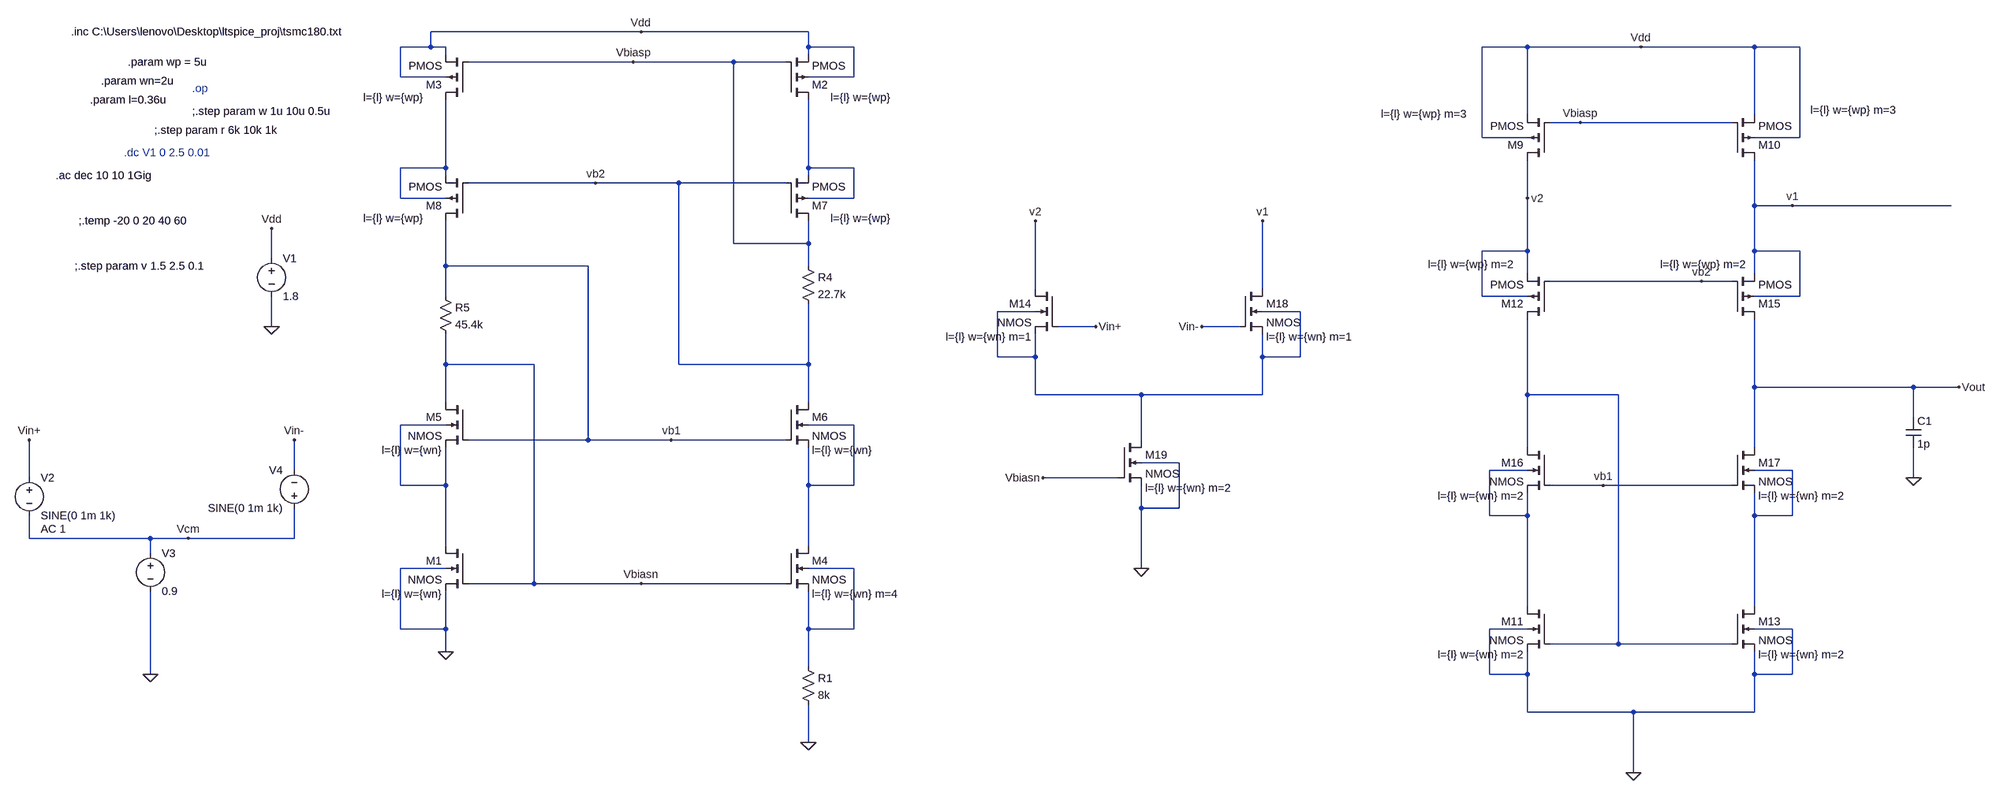
[diagram p0: schematic Folded_ntype.asc]
Folded_ntype.asc, the LTspice schematic file:
Version 4
SHEET 1 4044 2024
WIRE 240 -128 -288 -128
WIRE 752 -128 240 -128
WIRE -288 -96 -288 -128
WIRE -288 -96 -352 -96
WIRE -256 -96 -288 -96
WIRE 752 -96 752 -128
WIRE 848 -96 752 -96
WIRE 2320 -96 2224 -96
WIRE 2560 -96 2320 -96
WIRE 2800 -96 2560 -96
WIRE 2896 -96 2800 -96
WIRE -256 -80 -256 -96
WIRE 752 -80 752 -96
WIRE 224 -64 -208 -64
WIRE 464 -64 224 -64
WIRE 704 -64 464 -64
WIRE -352 -32 -352 -96
WIRE -256 -32 -352 -32
WIRE 848 -32 848 -96
WIRE 848 -32 752 -32
WIRE 2320 48 2320 -96
WIRE 2800 48 2800 -96
WIRE 2432 64 2368 64
WIRE 2752 64 2432 64
WIRE 2224 96 2224 -96
WIRE 2320 96 2224 96
WIRE 2896 96 2896 -96
WIRE 2896 96 2800 96
WIRE -256 160 -256 16
WIRE -256 160 -352 160
WIRE 752 160 752 16
WIRE 848 160 752 160
WIRE -256 176 -256 160
WIRE 752 176 752 160
WIRE 144 192 -208 192
WIRE 320 192 144 192
WIRE 704 192 320 192
WIRE -352 224 -352 160
WIRE -256 224 -352 224
WIRE 848 224 848 160
WIRE 848 224 752 224
WIRE 2320 224 2320 144
WIRE 2800 240 2800 144
WIRE 2880 240 2800 240
WIRE 3216 240 2880 240
WIRE 464 320 464 -64
WIRE 752 320 752 272
WIRE 752 320 464 320
WIRE 2320 336 2320 224
WIRE 2320 336 2224 336
WIRE 2800 336 2800 240
WIRE 2896 336 2800 336
WIRE -624 352 -624 288
WIRE -256 368 -256 272
WIRE 128 368 -256 368
WIRE 752 368 752 320
WIRE 2320 384 2320 336
WIRE 2800 384 2800 336
WIRE 2688 400 2368 400
WIRE 2752 400 2688 400
WIRE 1280 416 1280 272
WIRE 1760 416 1760 272
WIRE -256 432 -256 368
WIRE 2224 432 2224 336
WIRE 2320 432 2224 432
WIRE 2896 432 2896 336
WIRE 2896 432 2800 432
WIRE 1280 464 1200 464
WIRE 1840 464 1760 464
WIRE -624 496 -624 432
WIRE 1408 496 1328 496
WIRE 1712 496 1632 496
WIRE 1200 560 1200 464
WIRE 1280 560 1280 512
WIRE 1280 560 1200 560
WIRE 1760 560 1760 512
WIRE 1840 560 1840 464
WIRE 1840 560 1760 560
WIRE -256 576 -256 512
WIRE -48 576 -256 576
WIRE 320 576 320 192
WIRE 752 576 752 448
WIRE 752 576 320 576
WIRE 2800 624 2800 480
WIRE 3136 624 2800 624
WIRE 3232 624 3136 624
WIRE 1280 640 1280 560
WIRE 1504 640 1280 640
WIRE 1760 640 1760 560
WIRE 1760 640 1504 640
WIRE 2320 640 2320 480
WIRE 2512 640 2320 640
WIRE -256 656 -256 576
WIRE 752 656 752 576
WIRE 3136 688 3136 624
WIRE -256 704 -352 704
WIRE 848 704 752 704
WIRE 128 736 128 368
WIRE 128 736 -208 736
WIRE 304 736 128 736
WIRE 704 736 304 736
WIRE 1504 736 1504 640
WIRE 2320 752 2320 640
WIRE 2800 752 2800 624
WIRE 1584 784 1504 784
WIRE -576 800 -576 736
WIRE 2320 800 2240 800
WIRE 2880 800 2800 800
WIRE -1136 816 -1136 736
WIRE 1456 816 1296 816
WIRE 3136 816 3136 752
WIRE -352 832 -352 704
WIRE -256 832 -256 752
WIRE -256 832 -352 832
WIRE 752 832 752 752
WIRE 848 832 848 704
WIRE 848 832 752 832
WIRE 2480 832 2368 832
WIRE 2752 832 2480 832
WIRE 1504 880 1504 832
WIRE 1584 880 1584 784
WIRE 1584 880 1504 880
WIRE 2240 896 2240 800
WIRE 2320 896 2320 848
WIRE 2320 896 2240 896
WIRE 2800 896 2800 848
WIRE 2880 896 2880 800
WIRE 2880 896 2800 896
WIRE -1136 944 -1136 896
WIRE -880 944 -1136 944
WIRE -800 944 -880 944
WIRE -576 944 -576 880
WIRE -576 944 -800 944
WIRE -256 960 -256 832
WIRE 752 960 752 832
WIRE -880 976 -880 944
WIRE -256 1008 -352 1008
WIRE 848 1008 752 1008
WIRE 1504 1008 1504 880
WIRE -48 1040 -48 576
WIRE -48 1040 -208 1040
WIRE 240 1040 -48 1040
WIRE 704 1040 240 1040
WIRE 2320 1088 2320 896
WIRE 2800 1088 2800 896
WIRE -352 1136 -352 1008
WIRE -256 1136 -256 1056
WIRE -256 1136 -352 1136
WIRE 752 1136 752 1056
WIRE 848 1136 848 1008
WIRE 848 1136 752 1136
WIRE 2320 1136 2240 1136
WIRE 2880 1136 2800 1136
WIRE 2512 1168 2512 640
WIRE 2512 1168 2368 1168
WIRE 2752 1168 2512 1168
WIRE -256 1184 -256 1136
WIRE 752 1216 752 1136
WIRE -880 1232 -880 1056
WIRE 2240 1232 2240 1136
WIRE 2320 1232 2320 1184
WIRE 2320 1232 2240 1232
WIRE 2800 1232 2800 1184
WIRE 2880 1232 2880 1136
WIRE 2880 1232 2800 1232
WIRE 2320 1312 2320 1232
WIRE 2544 1312 2320 1312
WIRE 2800 1312 2800 1232
WIRE 2800 1312 2544 1312
WIRE 752 1376 752 1296
WIRE 2544 1440 2544 1312
FLAG -624 496 0
FLAG -624 288 Vdd
FLAG -256 1184 0
FLAG 752 1376 0
FLAG 240 1040 Vbiasn
FLAG 2560 -96 Vdd
FLAG -880 1232 0
FLAG -1136 736 Vin+
FLAG -800 944 Vcm
FLAG 3232 624 Vout
FLAG 3136 816 0
FLAG 304 736 vb1
FLAG 144 192 vb2
FLAG 2688 400 vb2
FLAG 2480 832 vb1
FLAG 240 -128 Vdd
FLAG 2544 1440 0
FLAG 224 -64 Vbiasp
FLAG -576 736 Vin-
FLAG 1408 496 Vin+
FLAG 1632 496 Vin-
FLAG 1296 816 Vbiasn
FLAG 1504 1008 0
FLAG 1760 272 v1
FLAG 2880 240 v1
FLAG 2320 224 v2
FLAG 1280 272 v2
FLAG 2432 64 Vbiasp
DATAFLAG 752 1184 ""
DATAFLAG 592 1040 ""
DATAFLAG -16 -64 ""
DATAFLAG 2656 -96 ""
DATAFLAG 2576 64 ""
DATAFLAG 592 736 ""
DATAFLAG -16 192 ""
DATAFLAG 2496 400 ""
DATAFLAG 2608 832 ""
DATAFLAG 2976 624 ""
DATAFLAG 3120 240 ""
SYMBOL pmos4 704 16 M180
WINDOW 123 95 5 Left 2
SYMATTR Value2 l={l} w={wp}
SYMATTR InstName M2
SYMBOL voltage -624 336 R0
SYMATTR InstName V1
SYMATTR Value 1.8
SYMBOL pmos4 -208 16 R180
WINDOW 123 95 5 Left 2
SYMATTR Value2 l={l} w={wp}
SYMATTR InstName M3
SYMBOL nmos4 -208 960 M0
WINDOW 123 56 102 Left 2
SYMATTR Value2 l={l} w={wn}
SYMATTR InstName M1
SYMBOL nmos4 704 960 R0
WINDOW 123 56 102 Left 2
SYMATTR Value2 l={l} w={wn} m=4
SYMATTR InstName M4
SYMBOL res 736 1200 R0
SYMATTR InstName R1
SYMATTR Value 8k
SYMBOL pmos4 2368 144 R180
WINDOW 123 176 98 Left 2
SYMATTR Value2 l={l} w={wp} m=3
SYMATTR InstName M9
SYMBOL pmos4 2752 144 M180
WINDOW 123 166 106 Left 2
SYMATTR Value2 l={l} w={wp} m=3
SYMATTR InstName M10
SYMBOL nmos4 2368 1088 M0
WINDOW 123 56 102 Left 2
SYMATTR Value2 l={l} w={wn} m=2
SYMATTR InstName M11
SYMBOL nmos4 2752 1088 R0
WINDOW 123 56 102 Left 2
SYMATTR Value2 l={l} w={wn} m=2
SYMATTR InstName M13
SYMBOL voltage -1136 800 R0
WINDOW 123 24 124 Left 2
WINDOW 39 0 0 Left 0
SYMATTR Value2 AC 1
SYMATTR InstName V2
SYMATTR Value SINE(0 1m 1k)
SYMBOL voltage -880 960 R0
SYMATTR InstName V3
SYMATTR Value 0.9
SYMBOL voltage -576 896 R180
WINDOW 0 24 96 Left 2
WINDOW 3 24 16 Left 2
WINDOW 123 24 -12 Left 2
WINDOW 39 0 0 Left 0
SYMATTR InstName V4
SYMATTR Value SINE(0 1m 1k)
SYMBOL cap 3120 688 R0
SYMATTR InstName C1
SYMATTR Value 1p
SYMBOL nmos4 -208 656 M0
WINDOW 123 56 102 Left 2
SYMATTR Value2 l={l} w={wn}
SYMATTR InstName M5
SYMBOL nmos4 704 656 R0
WINDOW 123 56 102 Left 2
SYMATTR Value2 l={l} w={wn}
SYMATTR InstName M6
SYMBOL pmos4 704 272 M180
WINDOW 123 95 5 Left 2
SYMATTR Value2 l={l} w={wp}
SYMATTR InstName M7
SYMBOL pmos4 -208 272 R180
WINDOW 123 95 5 Left 2
SYMATTR Value2 l={l} w={wp}
SYMATTR InstName M8
SYMBOL res 736 352 R0
SYMATTR InstName R4
SYMATTR Value 22.7k
SYMBOL res -272 416 R0
SYMATTR InstName R5
SYMATTR Value 45.4k
SYMBOL pmos4 2368 480 R180
WINDOW 123 77 116 Left 2
SYMATTR Value2 l={l} w={wp} m=2
SYMATTR InstName M12
SYMBOL pmos4 2752 480 M180
WINDOW 123 -151 116 Left 2
SYMATTR Value2 l={l} w={wp} m=2
SYMATTR InstName M15
SYMBOL nmos4 2368 752 M0
WINDOW 123 56 102 Left 2
SYMATTR Value2 l={l} w={wn} m=2
SYMATTR InstName M16
SYMBOL nmos4 2752 752 R0
WINDOW 123 56 102 Left 2
SYMATTR Value2 l={l} w={wn} m=2
SYMATTR InstName M17
SYMBOL nmos4 1328 416 M0
WINDOW 123 56 102 Left 2
SYMATTR Value2 l={l} w={wn} m=1
SYMATTR InstName M14
SYMBOL nmos4 1712 416 R0
WINDOW 123 56 102 Left 2
SYMATTR Value2 l={l} w={wn} m=1
SYMATTR InstName M18
SYMBOL nmos4 1456 736 R0
WINDOW 123 56 102 Left 2
SYMATTR Value2 l={l} w={wn} m=2
SYMATTR InstName M19
TEXT -1048 -128 Left 2 !.inc C:\\Users\\lenovo\\Desktop\\ltspice_proj\\tsmc180.txt
TEXT -792 -8 Left 2 ;.op
TEXT -792 40 Left 2 !;.step param w 1u 10u 0.5u
TEXT -872 80 Left 2 !;.step param r 6k 10k 1k
TEXT -936 128 Left 2 ;.dc V1 0 2.5 0.01
TEXT -1080 176 Left 2 !.ac dec 10 10 1Gig
TEXT -1032 272 Left 2 !;.temp -20 0 20 40 60
TEXT -1040 368 Left 2 !;.step param v 1.5 2.5 0.1
TEXT -928 -64 Left 2 !.param wp = 5u
TEXT -984 -24 Left 2 !.param wn=2u
TEXT -1008 16 Left 2 !.param l=0.36u

The netlist it stands for:
* Folded_ntype.asc
M2 N002 Vbiasp Vdd Vdd PMOS l={l} w={wp}
V1 Vdd 0 1.8
M3 N001 Vbiasp Vdd Vdd PMOS l={l} w={wp}
M1 N005 Vbiasn 0 0 NMOS l={l} w={wn}
M4 N006 Vbiasn N009 N009 NMOS l={l} w={wn} m=4
R1 N009 0 8k
M9 v2 Vbiasp Vdd Vdd PMOS l={l} w={wp} m=3
M10 v1 Vbiasp Vdd Vdd PMOS l={l} w={wp} m=3
M11 N007 N004 0 0 NMOS l={l} w={wn} m=2
M13 N008 N004 0 0 NMOS l={l} w={wn} m=2
V2 Vin+ Vcm SINE(0 1m 1k) AC 1
V3 Vcm 0 0.9
V4 Vcm Vin- SINE(0 1m 1k)
C1 Vout 0 1p
M5 Vbiasn vb1 N005 N005 NMOS l={l} w={wn}
M6 vb2 vb1 N006 N006 NMOS l={l} w={wn}
M7 Vbiasp vb2 N002 N002 PMOS l={l} w={wp}
M8 vb1 vb2 N001 N001 PMOS l={l} w={wp}
R4 Vbiasp vb2 22.7k
R5 vb1 Vbiasn 45.4k
M12 N004 vb2 v2 v2 PMOS l={l} w={wp} m=2
M15 Vout vb2 v1 v1 PMOS l={l} w={wp} m=2
M16 N004 vb1 N007 N007 NMOS l={l} w={wn} m=2
M17 Vout vb1 N008 N008 NMOS l={l} w={wn} m=2
M14 v2 Vin+ N003 N003 NMOS l={l} w={wn} m=1
M18 v1 Vin- N003 N003 NMOS l={l} w={wn} m=1
M19 N003 Vbiasn 0 0 NMOS l={l} w={wn} m=2
.model NMOS NMOS
.model PMOS PMOS
.lib standard.mos
.inc C:\Users\lenovo\Desktop\ltspice_proj\tsmc180.txt
* .op
;.step param w 1u 10u 0.5u
;.step param r 6k 10k 1k
* .dc V1 0 2.5 0.01
.ac dec 10 10 1Gig
;.temp -20 0 20 40 60
;.step param v 1.5 2.5 0.1
.param wp = 5u
.param wn=2u
.param l=0.36u
.backanno
.end